# EAGLE design sch (EAGLE 9.3.1)
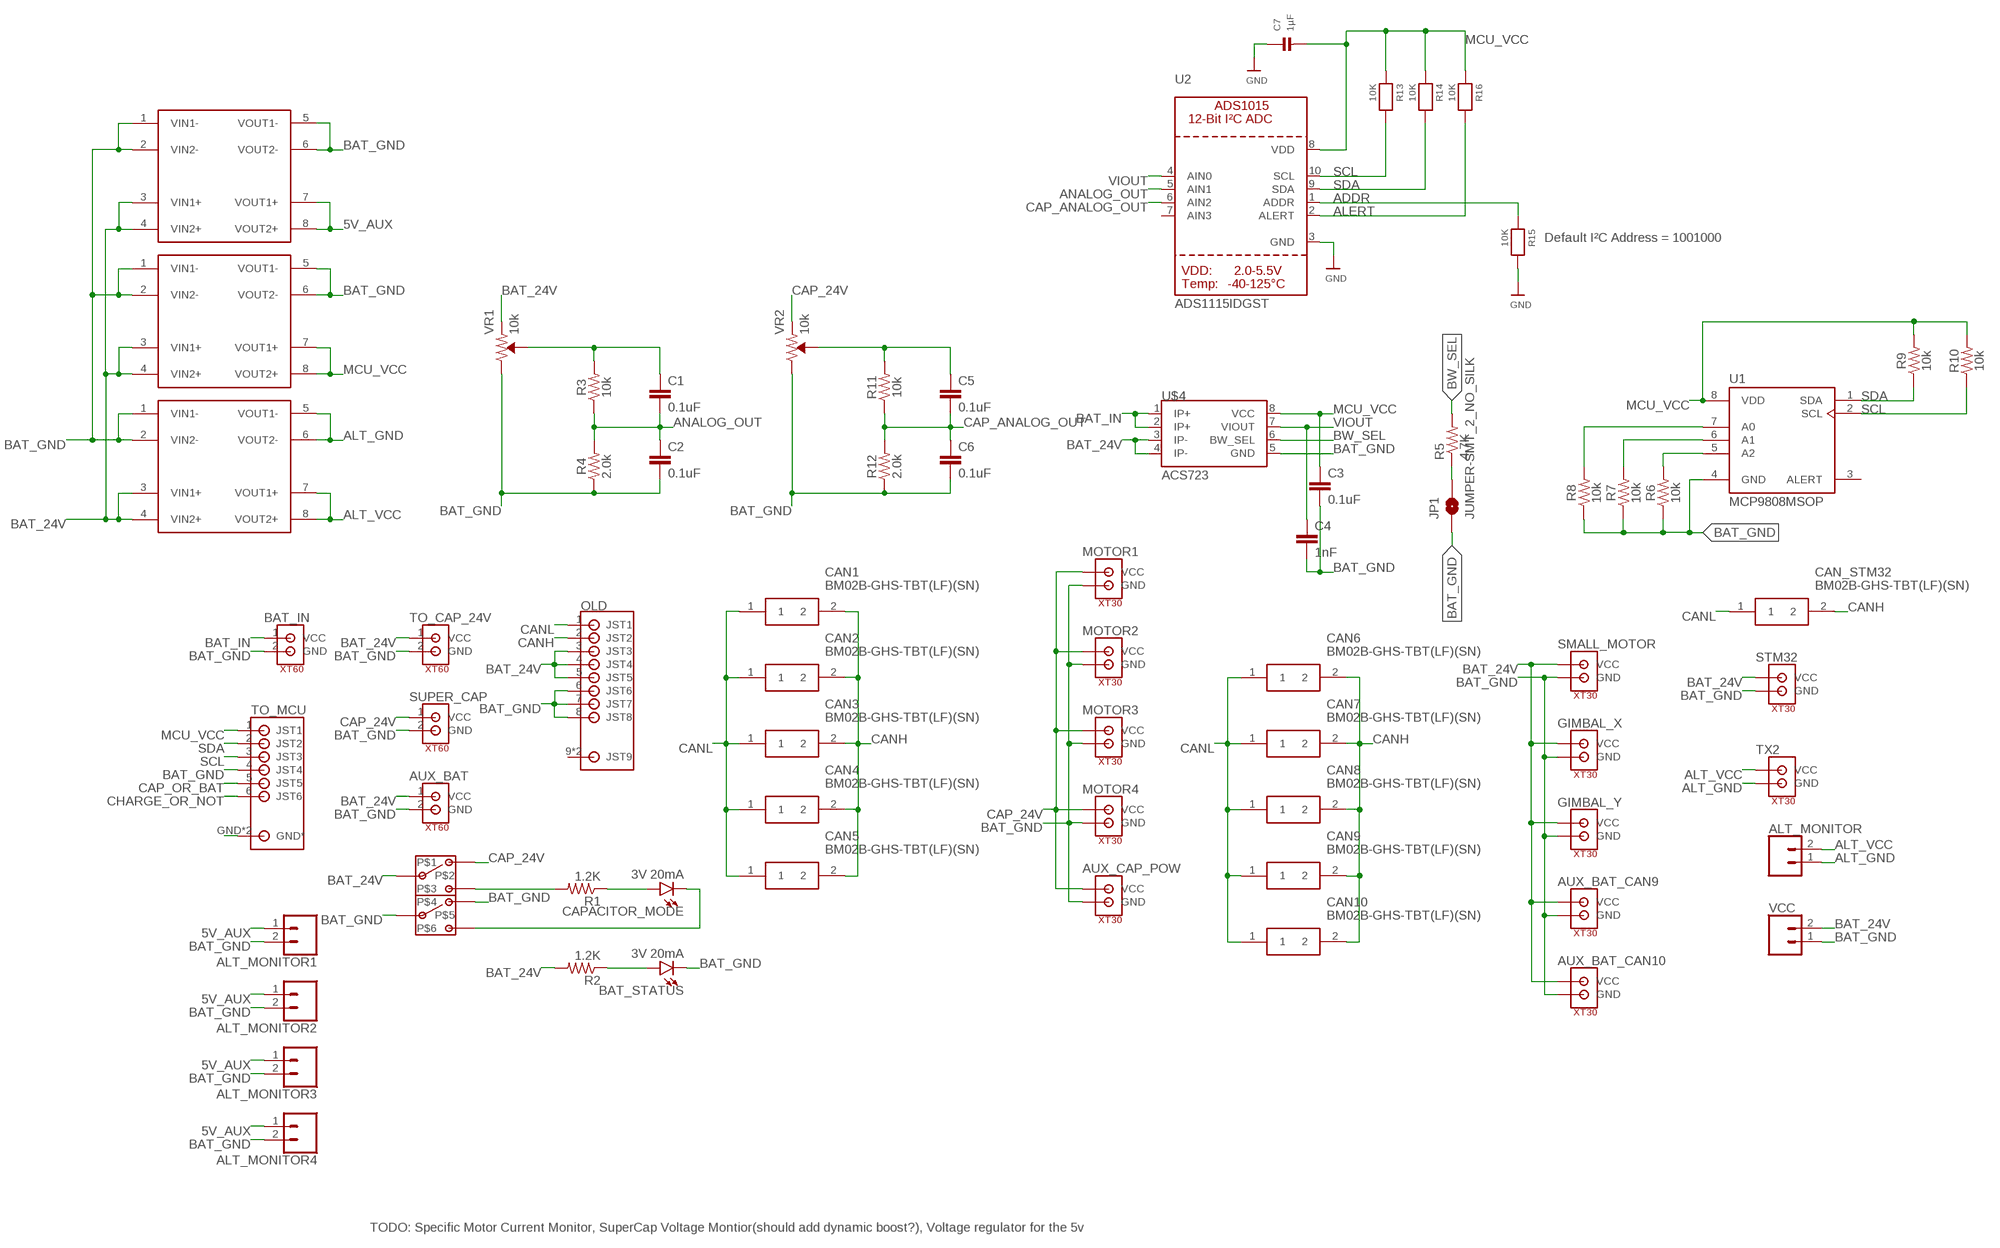
[diagram p0: schematic, sheet 1]

## Parts
ALT_MONITOR  CONN_02  [1X02]
ALT_MONITOR1  CONN_02  [1X02]
ALT_MONITOR2  CONN_02  [1X02]
ALT_MONITOR3  CONN_02  [1X02]
ALT_MONITOR4  CONN_02  [1X02]
AUX_BAT  XT60  [XT60]
AUX_BAT_CAN9  XT30  [XT30]
AUX_BAT_CAN10  XT30  [XT30]
AUX_CAP_POW  XT30  [XT30]
BAT_IN  XT60  [XT60]
BAT_STATUS  3V 20mA  LED1206  [LED-1206]
C1  0.1uF  0.1UF-0603-25V-(+80/-20%)  [0603]
C2  0.1uF  0.1UF-0603-25V-(+80/-20%)  [0603]
C3  0.1uF  0.1UF-0603-25V-(+80/-20%)  [0603]
C4  1nF  1.0NF/1000PF-0603-50V-10%  [0603]
C5  0.1uF  0.1UF-0603-25V-(+80/-20%)  [0603]
C6  0.1uF  0.1UF-0603-25V-(+80/-20%)  [0603]
C7  1µF  CAP_CERAMIC0805  [0805]
CAN1  BM02B-GHS-TBT(LF)(SN)  [BM02B-GHS-TBT_1]
CAN2  BM02B-GHS-TBT(LF)(SN)  [BM02B-GHS-TBT_1]
CAN3  BM02B-GHS-TBT(LF)(SN)  [BM02B-GHS-TBT_1]
CAN4  BM02B-GHS-TBT(LF)(SN)  [BM02B-GHS-TBT_1]
CAN5  BM02B-GHS-TBT(LF)(SN)  [BM02B-GHS-TBT_1]
CAN6  BM02B-GHS-TBT(LF)(SN)  [BM02B-GHS-TBT_1]
CAN7  BM02B-GHS-TBT(LF)(SN)  [BM02B-GHS-TBT_1]
CAN8  BM02B-GHS-TBT(LF)(SN)  [BM02B-GHS-TBT_1]
CAN9  BM02B-GHS-TBT(LF)(SN)  [BM02B-GHS-TBT_1]
CAN10  BM02B-GHS-TBT(LF)(SN)  [BM02B-GHS-TBT_1]
CAN_STM32  BM02B-GHS-TBT(LF)(SN)  [BM02B-GHS-TBT_1]
CAPACITOR_MODE  3V 20mA  LED1206  [LED-1206]
GIMBAL_X  XT30  [XT30]
GIMBAL_Y  XT30  [XT30]
JP1  JUMPER-SMT_2_NO_SILK  [SMT-JUMPER_2_NO_SILK]
MOTOR1  XT30  [XT30]
MOTOR2  XT30  [XT30]
MOTOR3  XT30  [XT30]
MOTOR4  XT30  [XT30]
OLD  S8B-PH-SM4_TB  [S8B-PH-SM4_TB]
R1  1.2K  RESISTOR2010  [R2010]
R2  1.2K  RESISTOR2010  [R2010]
R3  10k  10KOHM-0603-1/10W-1%  [0603]
R4  2.0k  2.0KOHM-0603-1/10W-5%  [0603]
R5  4.7K  4.7KOHM-1/10W-1%(0603)  [0603-RES]
R6  10k  10KOHM-0603-1/10W-1%  [0603]
R7  10k  10KOHM-0603-1/10W-1%  [0603]
R8  10k  10KOHM-0603-1/10W-1%  [0603]
R9  10k  10KOHM-0603-1/10W-1%  [0603]
R10  10k  10KOHM-0603-1/10W-1%  [0603]
R11  10k  10KOHM-0603-1/10W-1%  [0603]
R12  2.0k  2.0KOHM-0603-1/10W-5%  [0603]
R13  10K  RESISTOR0805  [0805]
R14  10K  RESISTOR0805  [0805]
R15  10K  RESISTOR0805  [0805]
R16  10K  RESISTOR0805  [0805]
SMALL_MOTOR  XT30  [XT30]
STM32  XT30  [XT30]
SUPER_CAP  XT60  [XT60]
TO_CAP_24V  XT60  [XT60]
TO_MCU  S6B-PH-SM4_TB  [S6B-PH-SM4_TB]
TX2  XT30  [XT30]
U1  MCP9808MSOP  [MSOP-8]
U2  ADS1115IDGST  ADC_ADS1015  [MSOP10]
U$1  MP1584  [MP1584_AMAZON]
U$2  MP1584  [MP1584_AMAZON]
U$3  DPDT  [DPDT]
U$4  ACS723  [SO08]
U$5  MP1584  [MP1584_AMAZON]
VCC  CONN_02  [1X02]
VR1  10k  TRIMPOT-SMD-3MM-OPEN-1/10W-25%  [TRIMPOT-SMD-TC33X]
VR2  10k  TRIMPOT-SMD-3MM-OPEN-1/10W-25%  [TRIMPOT-SMD-TC33X]

## Nets
5V_AUX: ALT_MONITOR1.1 ALT_MONITOR2.1 ALT_MONITOR3.1 ALT_MONITOR4.1 U$5.7(VOUT1+) U$5.8(VOUT2+)
ADDR: R15.1 U2.1(ADDR)
ALERT: R16.2 U2.2(ALERT)
ALT_GND [sig]: ALT_MONITOR.1 TX2.P$1(GND) U$2.5(VOUT1-) U$2.6(VOUT2-)
ALT_VCC [sig]: ALT_MONITOR.2 TX2.P$2(VCC) U$2.7(VOUT1+) U$2.8(VOUT2+)
ANALOG_OUT [sig]: C1.2 C2.1 R3.1 R4.2 U2.5(AIN1)
BAT_24V: AUX_BAT.1(VCC) AUX_BAT_CAN9.P$2(VCC) AUX_BAT_CAN10.P$2(VCC) GIMBAL_X.P$2(VCC) GIMBAL_Y.P$2(VCC) OLD.3(JST3) OLD.4(JST4) OLD.5(JST5) R2.2 SMALL_MOTOR.P$2(VCC) STM32.P$2(VCC) TO_CAP_24V.1(VCC) U$1.3(VIN1+) U$1.4(VIN2+) U$2.3(VIN1+) U$2.4(VIN2+) U$3.P$2 U$4.3(IP-) U$4.4(IP-) U$5.3(VIN1+) U$5.4(VIN2+) VCC.2 VR1.3(CCW)
BAT_GND: ALT_MONITOR1.2 ALT_MONITOR2.2 ALT_MONITOR3.2 ALT_MONITOR4.2 AUX_BAT.2(GND) AUX_BAT_CAN9.P$1(GND) AUX_BAT_CAN10.P$1(GND) AUX_CAP_POW.P$1(GND) BAT_IN.2(GND) BAT_STATUS.C C2.2 C3.2 C4.2 C6.2 GIMBAL_X.P$1(GND) GIMBAL_Y.P$1(GND) JP1.1 MOTOR1.P$1(GND) MOTOR2.P$1(GND) MOTOR3.P$1(GND) MOTOR4.P$1(GND) OLD.6(JST6) OLD.7(JST7) OLD.8(JST8) R4.1 R6.1 R7.1 R8.1 R12.1 SMALL_MOTOR.P$1(GND) STM32.P$1(GND) SUPER_CAP.2(GND) TO_CAP_24V.2(GND) TO_MCU.4(JST4) U1.4(GND) U$1.1(VIN1-) U$1.2(VIN2-) U$1.5(VOUT1-) U$1.6(VOUT2-) U$2.1(VIN1-) U$2.2(VIN2-) U$3.P$4 U$3.P$5 U$4.5(GND) U$5.1(VIN1-) U$5.2(VIN2-) U$5.5(VOUT1-) U$5.6(VOUT2-) VCC.1 VR1.1(CW) VR2.1(CW)
BAT_IN: BAT_IN.1(VCC) U$4.1(IP+) U$4.2(IP+)
BW_SEL [sig]: R5.2 U$4.6(BW_SEL)
CANH [sig]: CAN1.2 CAN2.2 CAN3.2 CAN4.2 CAN5.2 CAN6.2 CAN7.2 CAN8.2 CAN9.2 CAN10.2 CAN_STM32.2 OLD.2(JST2)
CANL [sig]: CAN1.1 CAN2.1 CAN3.1 CAN4.1 CAN5.1 CAN6.1 CAN7.1 CAN8.1 CAN9.1 CAN10.1 CAN_STM32.1 OLD.1(JST1)
CAP_24V: AUX_CAP_POW.P$2(VCC) MOTOR1.P$2(VCC) MOTOR2.P$2(VCC) MOTOR3.P$2(VCC) MOTOR4.P$2(VCC) SUPER_CAP.1(VCC) U$3.P$1 VR2.3(CCW)
CAP_ANALOG_OUT: C5.2 C6.1 R11.1 R12.2 U2.6(AIN2)
CAP_OR_BAT: TO_MCU.5(JST5)
CHARGE_OR_NOT: TO_MCU.6(JST6)
GND: C7.1 R15.2 U2.3(GND)
MCU_VCC [sig]: C3.1 C7.2 R9.2 R10.2 R13.1 R14.1 R16.1 TO_MCU.1(JST1) U1.8(VDD) U2.8(VDD) U$1.7(VOUT1+) U$1.8(VOUT2+) U$4.8(VCC)
N$1 [sig]: R1.2 U$3.P$3
N$2 [sig]: CAPACITOR_MODE.A R1.1
N$3 [sig]: CAPACITOR_MODE.C U$3.P$6
N$4 [sig]: JP1.2 R5.1
N$5 [sig]: BAT_STATUS.A R2.1
N$6 [sig]: C5.1 R11.2 VR2.2(WIPER)
N$7: TO_MCU.GND2(GND*) TO_MCU.GND(GND*)
N$8 [sig]: C1.1 R3.2 VR1.2(WIPER)
N$13 [sig]: R8.2 U1.7(A0)
N$14 [sig]: R7.2 U1.6(A1)
N$15 [sig]: R6.2 U1.5(A2)
SCL [sig]: R10.1 R13.2 TO_MCU.3(JST3) U1.2(SCL) U2.10(SCL)
SDA [sig]: R9.1 R14.2 TO_MCU.2(JST2) U1.1(SDA) U2.9(SDA)
VIOUT [sig]: C4.1 U2.4(AIN0) U$4.7(VIOUT)
Unconnected: OLD.9(JST9) OLD.10(JST9) U1.3(ALERT) U2.7(AIN3)

## Notes on the sheet
- Default I²C Address = 1001000
- TODO: Specific Motor Current Monitor, SuperCap Voltage Montior(should add dynamic boost?), Voltage regulator for the 5v

## Library data of the parts
ALT_MONITOR ALT_MONITOR1-ALT_MONITOR4 VCC = SparkFun-Connectors:CONN_02: Multi connection point. Often used as Generic Header-pin footprint for 0.1 inch spaced/style header connections On any of the 0.1 inch spaced packages, you can populate with these: Break Away Headers - Straight <https://www.sparkfun.com/products/116> (PRT-00116) Break Away Male Headers - Right Angle <https://www.sparkfun.com/products/553> (PRT-00553) Female Headers <https://www.sparkfun.com/products/115> (PRT-00115) Break Away Headers - Machine Pin <https://www.sparkfun.com/products/117> (PRT-00117) Break Away Female Headers - Swiss Machine Pin <https://www.sparkfun.com/products/743> (PRT-00743) For SCREWTERMINALS and SPRING TERMINALS visit here: Screw Terimnals on SparkFun.com <https://www.sparkfun.com/search/results?term=Screw+Terminals> (5mm/3.5mm/2.54mm spacing) This device is also useful as a general connection point to wire up your design to another part of your project. Our various solder wires solder well into these plated through hole pads. Hook-Up Wire - Assortment (Stranded, 22 AWG) <https://www.sparkfun.com/products/11375> (PRT-11375) Hook-Up Wire - Assortment (Solid Core, 22 AWG) <https://www.sparkfun.com/products/11367> (PRT-11367) View the entire wire category on our website here <https://www.sparkfun.com/categories/141> Special notes: Molex polarized connector foot print use with: PRT-08233 with associated crimp pins and housings. 2.54_SCREWTERM for use with PRT-10571. 3.5mm Screw Terminal footprints for PRT-08084 5mm Screw Terminal footprints for use with PRT-08432
AUX_BAT BAT_IN SUPER_CAP TO_CAP_24V = NewKevinMade:XT60
AUX_BAT_CAN9 AUX_BAT_CAN10 AUX_CAP_POW GIMBAL_X GIMBAL_Y MOTOR1-MOTOR4 SMALL_MOTOR STM32 TX2 = NewKevinMade:XT30
BAT_STATUS CAPACITOR_MODE = SparkFun-LED:LED: LED (Generic) Standard schematic elements and footprints for 5mm, 3mm, 1206, and 0603 sized LEDs. Generic LEDs with no color specified.
C1-C3 C5 C6 = SparkFun-Capacitors:0.1UF: 0.1µF ceramic capacitors A capacitor is a passive two-terminal electrical component used to store electrical energy temporarily in an electric field.; PROD_ID: CAP-00810
C4 = SparkFun-Capacitors:1.0NF/1000PF: 1nF/1,000pF ceramic capacitors A capacitor is a passive two-terminal electrical component used to store electrical energy temporarily in an electric field.; PROD_ID: CAP-07886
C7 = microbuilder:CAP_CERAMIC: Ceramic Capacitors 0402 - 0402 Surface Mount Capacitors 16pF 50V 5% [Digikey: 445-4899-2-ND] 18pF 50V 5% [Digikey: 490-1281-2-ND] 22pF 50V 5% [Digikey: 490-1283-2-ND] 68pF 50V 5% [Digikey: 490-1289-2-ND] 0.1uF 10V 10% [Digikey: 490-1318-2-ND] 1.0uF 6.3V 10% [Digikey: 490-1320-2-ND] 0603 - 0603 Surface Mount Capacitors 16 pF 50V 5% [Digikey: 445-5051-2-ND] 22 pF 50V [Digikey: PCC220ACVTR-ND] 33 pF 50V 5% [Digikey: 490-1415-1-ND] 56pF 50V 5% [Digikey: 490-1421-1-ND] 220pF 50V 5% [Digikey: 445-1285-1-ND] 680 pF 50V 2200 pF 50V 5% C0G [Digikey: 445-1297-1-ND] 5600 pF 100V 5% X7R [Digikey: 478-3711-1-ND] 0.1 µF 25V 10% [Digikey: PCC2277TR-ND] 0.22 µF 16V 10% X7R [Digikey: 445-1318-1-ND] 1.0 µF 25V 10% [Digikey: 445-5146-2-ND] 0603 - RF Specific 3pF 250V +/-0.1pF RF [Digikey: 712-1347-1-ND] 18 pF 250V 5% [Digikey: 478-3505-1-ND or 712-1322-1-ND] 56 pF 250V 5% C0G RF [Digikey: 490-4867-1-ND] 68 pF 250V RF [Digikey: 490-4868-1-ND] 0805 - 0805 Surface Mount Capacitors 220 pF 250V 2% RF Ceramic Capacitor [Digikey: 712-1398-1-ND] 1000 pF 50V 2% NP0 Ceramic Capacitor [Digikey: 478-3760-1-ND] 0.1 µF 25V 10% Ceramic Capacitor [Digikey: PCC1828TR-ND] 1.0 µF 16V 10% Ceramic Capacitor[Digikey: 490-1691-2-ND] 10.0 µF 10V 10% Ceramic Capacitor[Digikey: 709-1228-1-ND] 10.0 uF 16V 10% Ceramic Capacitor [Digikey: 478-5165-2-ND] 47 uF 6.3V 20% Ceramic Capacitor [Digikey: 587-1779-1-ND or 399-5506-1-ND] 1206 - 1206 Surface Mount Capacitors 47uF 10V 20% Ceramic Capacitor [Digikey: 490-5528-1-ND or 399-5508-1-ND or 445-6010-1-ND] 100uF 6.3V -20%, +80% Y5V Ceramic Capacitor (Digikey: 490-4512-1-ND, Mouser: 81-GRM31CF50J107ZE1L)
CAN1-CAN10 CAN_STM32 = SamacSys_Parts:BM02B-GHS-TBT(LF)(SN): GH 1.25mm header top entry 2 way JST GH Series, 1.25mm Pitch 2 Way Shrouded Straight PCB Header, Surface Mount, Solder Termination Source: Datasheet <http://uk.rs-online.com/web/p/products/7521762P>; DESCRIPTION: GH 1.25mm header top entry 2 way JST GH Series, 1.25mm Pitch 2 Way Shrouded Straight PCB Header, Surface Mount, Solder Termination; HEIGHT: mm; MANUFACTURER_NAME: JST (JAPAN SOLDERLESS TERMINALS); MANUFACTURER_PART_NUMBER: BM02B-GHS-TBT(LF)(SN); RS_PART_NUMBER: 7521762P
JP1 = SparkFun-Jumpers:JUMPER-SMT_2_NO: Normally open jumper This jumper has two pads in close proximity to each other. Apply solder to close the connection. Round pads are easier to solder for beginners, but are a lot larger. SparkFun Product that uses the round pads: SparkFun EL Sequencer <https://www.sparkfun.com/products/12781>
OLD = KevinMade:S8B-PH-SM4_TB
R1 R2 = SparkFun-Passives:RESISTOR: Resistor Basic schematic elements and footprints for 0603, 1206, and PTH resistors.
R3 R6-R11 = SparkFun-Resistors:10KOHM: 10kΩ resistor A resistor is a passive two-terminal electrical component that implements electrical resistance as a circuit element. Resistors act to reduce current flow, and, at the same time, act to lower voltage levels within circuits. - Wikipedia; PROD_ID: RES-00824
R4 R12 = SparkFun-Resistors:2.0KOHM: 2kΩ resistor A resistor is a passive two-terminal electrical component that implements electrical resistance as a circuit element. Resistors act to reduce current flow, and, at the same time, act to lower voltage levels within circuits. - Wikipedia; PROD_ID: RES-08296
R5 = SparkFun-Resistors:4.7KOHM-1/10W-1%(0603): RES-07857; PROD_ID: RES-07857
R13-R16 = microbuilder:RESISTOR: Resistors 0402 - 0402 Surface Mount Package 22 Ohm 1% 1/16W [Digikey: 311-22.0LRTR-ND] 33 Ohm 5% 1/16W 1.0K 5% 1/16W 1.5K 5% 1/16W 2.0K 1% 1/16W 10.0K 1% 1/16W [Digikey: 311-10.0KLRTR-ND] 10.0K 5% 1/16W [Digikey: RMCF0402JT10K0TR-ND] 12.1K 1% 1/16W [Digikey: 311-22.0LRTR-ND] 100.0K 5% 1/16W 0603 - 0603 Surface Mount Package 0 Ohm 1/10 Watt 1% Resistor 15 Ohm 1/10 Watt 1% Resistor 33 Ohm 1/10 Watt 1% Resistor 49.9 Ohm 1/10 Watt 1% Resistor 100 Ohm 1/10 Watt 1% Resistor 150 Ohm 1/10 Watt 1% Resistor 240 Ohm 1/10 Watt 1% Resistor 390 Ohm 1/10 Watt 1% Resistor 560 Ohm 1/10 Watt 1% Resistor 680 Ohm 1/10 Watt 1% Resistor 750 Ohm 1/10 Watt 1% Resistor 1.0K Ohm 1/10 Watt 1% Resistor 1.5K Ohm 1/10 Watt 1% Resistor 2.0K Ohm 1/10 Watt 1% Resistor 2.2K Ohm 1/10 Watt 1% Resistor 3.3K Ohm 1/10 Watt 1% Resistor 4.7K Ohm 1/10 Watt 1% Resistor 10.0K Ohm 1/10 Watt 1% Resistor 12.0K Ohm 1/10 Watt 1% Resistor 12.1K Ohm 1/10 Watt 1% Resistor 20.0K Ohm 1/10 Watt 1% Resistor 33.0K Ohm 1/10 Watt 1% Resistor 100.0K Ohm 1/10 Watt 1% Resistor 0805 - 0805 Surface Mount Package 0 Ohm 1/8 Watt 1% Resistor 33 Ohm 1/8 Watt 1% Resistor 100 Ohm 1/8 Watt 1% Resistor 150 Ohm 1/8 Watt 1% Resistor 200 Ohm 1/8 Watt 1% Resistor 240 Ohm 1/8 Watt 1% Resistor 330 Ohm 1/8 Watt 1% Resistor 390 Ohm 1/8 Watt 1% Resistor 470 Ohm 1/8 Watt 1% Resistor 1.0K Ohm 1/8 Watt 1% Resistor 1.5K Ohm 1/8 Watt 1% Resistor 2.0K Ohm 1/8 Watt 1% Resistor 4.7K Ohm 1/8 Watt 1% Resistor 5.1K Ohm 1/8 Watt 1% Resistor 5.6K Ohm 1/8 Watt 1% Resistor 10.0K Ohm 1/8 Watt 1% Resistor 22.0K Ohm 1/8 Watt 1% Resistor 33.0K Ohm 1/8 Watt 1% Resistor 100K Ohm 1/8 Watt 1% Resistor 1206 - 1206 Surface Mount Package 2012 - 2010 Surface Mount Package 0.11 Ohm 1/2 Watt 1% Resistor - Digikey: RHM.11UCT-ND
TO_MCU = NewKevinMade:S6B-PH-SM4_TB
U1 = MCP9808:MCP9808; AVAILABILITY: Unavailable; DESCRIPTION: MCP9808 Series SMD 3.6 V Memory Module Digital Temperature Sensor - MSOP-8; MF: Microchip; MP: MCP9808-E/MS; PACKAGE: MSOP-8 Microchip; PRICE: None
U2 = microbuilder:ADC_ADS1015: ADS1015 - 12-bit 4-Channel I2C ADC with Internal PGA VDD: 2.0-5.5V Sampling Rate: 3.3ksps Gain Settings: 2/3, 1, 2, 4, 8, 16 I2C Address: ADDR low = 1001000x, ADDR high = 1001001x Internal Comparator The ADS1015 includes an internal comparator that can be set to output a high-level on ALERT when the conversion results exceeeds a pre-defined upper level, and will deassert itself when the level falls below a pre-defined lower threshold level. It can also be set to windowed mode where the ALERT pin will be asserted if the data exceeds the upper threshold or falls below the lower threshold.
U$1 U$2 U$5 = NewKevinMade:MP1584
U$3 = NewKevinMade:DPDT
U$4 = SparkFun-Sensors:ACS723; PART_#: ACS723ACS723LLCTR-05AB-T2; PROD_ID: IC-13872
VR1 VR2 = SparkFun-Resistors:TRIMPOT: Trimming Potentiometer (Trimpot) Three-terminal potentiometers, with an adjustable wiper and two adjustable resistors. A pot can be used to create a configurable voltage divider, or as a variable resistor. "Trimpots" are a subset of potentiometers, usually intended for "set-and-forget" applications. They're often more delicate than standard potentiometers - rated for fewer turns. Variants PTH-KNOB - PTH Trimpot w/ finger-adjustable knob Trimpot 10K with Knob <https://www.sparkfun.com/products/9806> (COM-09806) Datasheet <http://www.sparkfun.com/datasheets/Components/General/TSR-3386.pdf> SMD-3MM-CLOSED-FRAME - SMD 3mm Square Closed-Frame Trimpot Used on e.g. EasyDriver - Stepper Motor Driver <https://www.sparkfun.com/products/12779> Datasheet <http://www.bitechnologies.com/pdfs/22.pdf> (22AR10KTR) SMD-5MM - SMD 5mm Square Closed-Frame Trimpot Used on e.g. IOIO-OTG - V2.2 <https://www.sparkfun.com/products/13613> Datasheet <http://www.vishay.com/docs/51008/ts53.pdf> (TS53YL502MR10) SMD-3MM-1/10W-25% - 3mm Square Open-Frame Trimpot Used on e.g. SparkFun Shapeoko <https://www.sparkfun.com/products/13899> Datasheet <http://www.bourns.com/docs/Product-Datasheets/TC33.pdf> (TC33X-2-103E); PROD_ID: RES-12428, RES-08048

## Net classes
0 default: width 1.778 mm, drill 1.016 mm, clearance 0.508 mm
1 sig: width 0.254 mm, drill 0.305 mm, clearance 0.254 mm

## Board
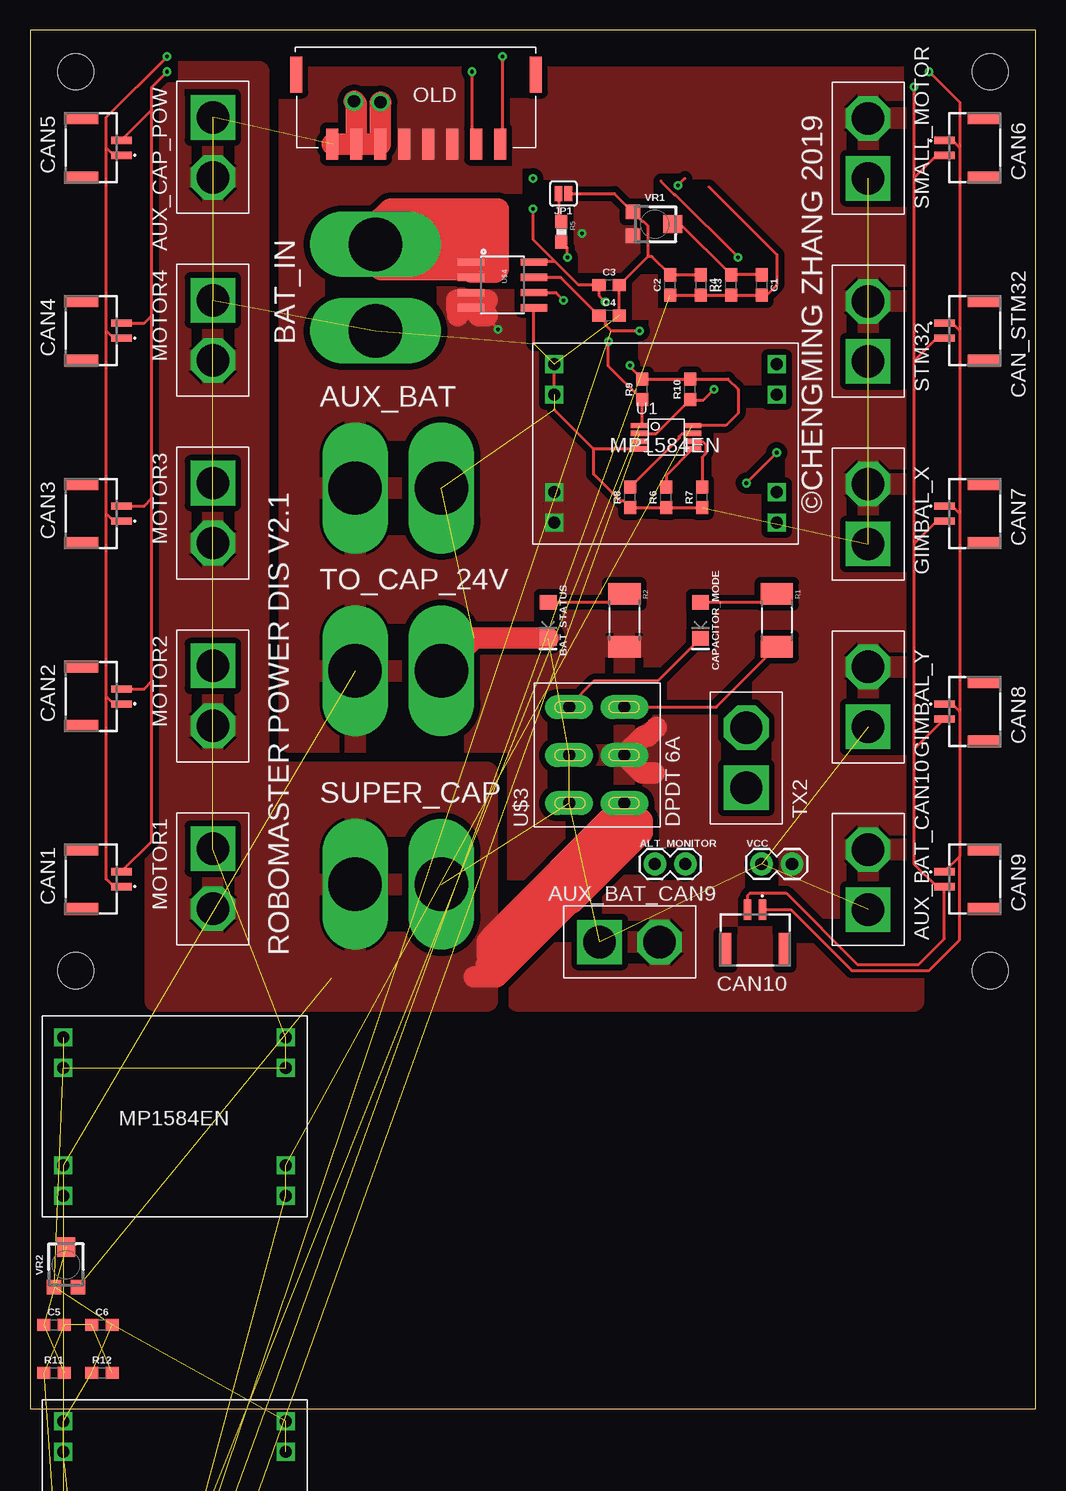
[diagram p1: board, top side]
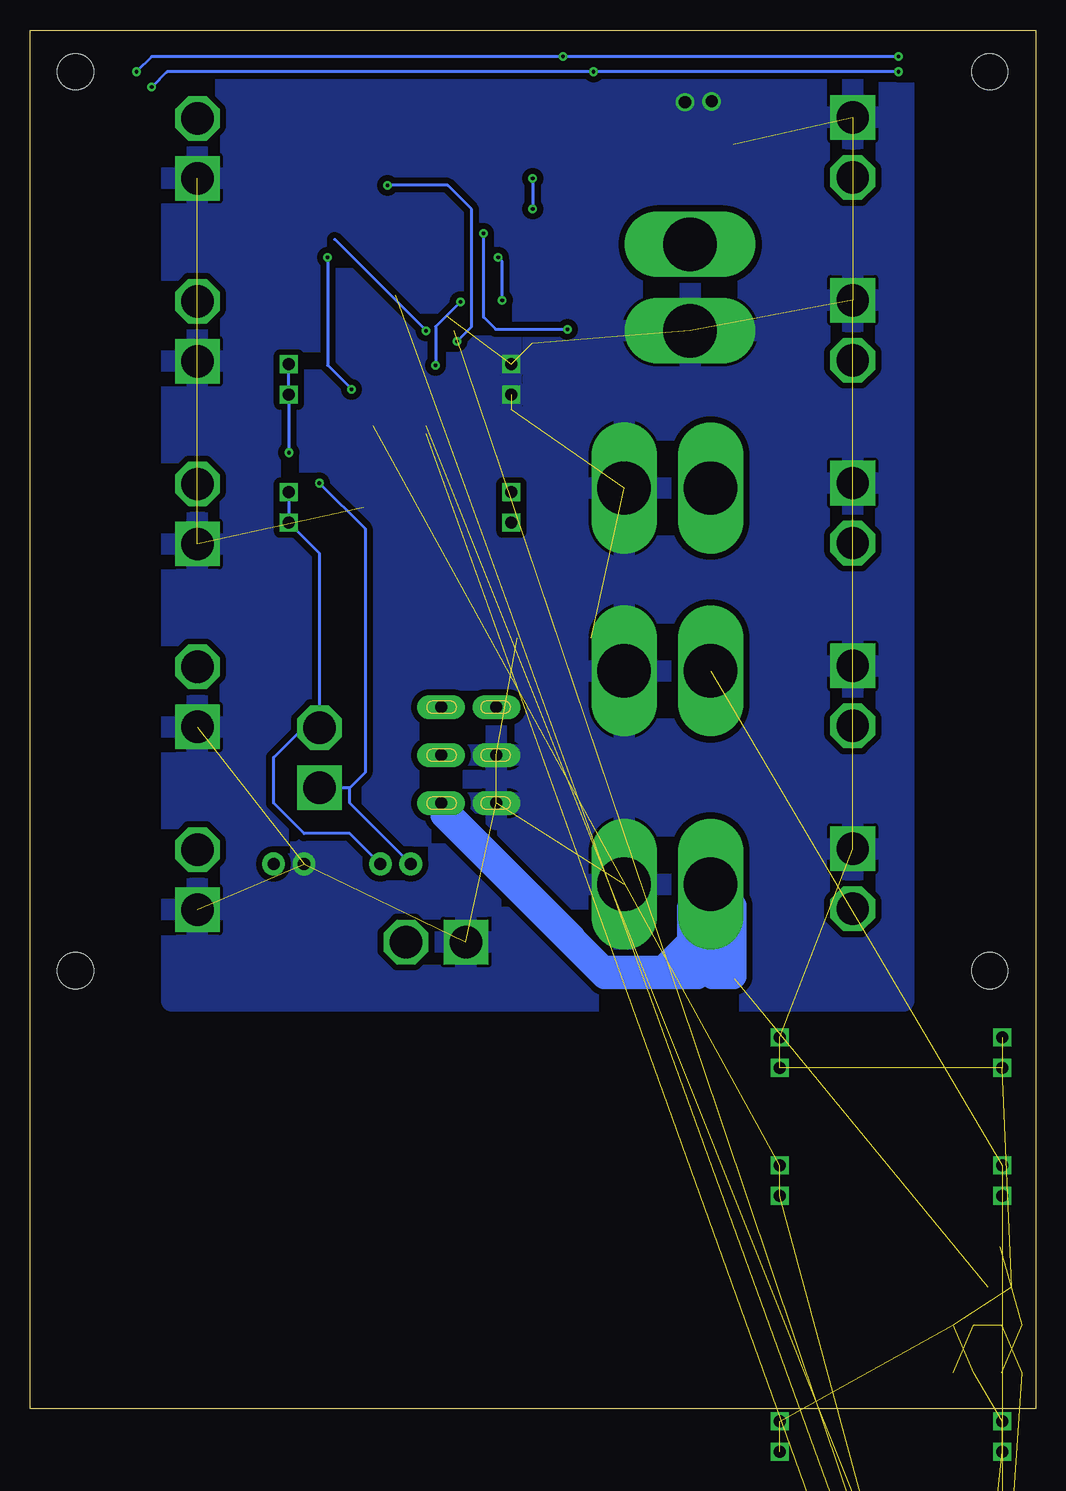
[diagram p2: board, bottom side, seen from below]

Size 83.8 x 114.95 mm. Coordinates in mm from the lower left corner, seen from the top.
Outline: 0,0 83.8,0 83.8,114.95 0,114.95 0,0
Copper layers (1*16): Top 0.035mm / dielectric 1.5mm / Bottom 0.035mm
Design rules "default": minimum track width 6mil, minimum drill 0.35mm, track to track 6mil, track to pad 6mil, pad to pad 6mil, via to via 6mil, smd to smd 6mil, copper to edge 40mil, drill to drill 6mil, minimum pad ring 10mil, minimum via ring 8mil, stop-mask expansion 4mil, vias tented up to drill 0mil, thermal gap 10mil
Holes 3 mm at 3.81,111.47 80.01,111.47 80.01,36.54 3.81,36.54
Milling: 24 lines

### Footprints (pad centres in the part's own frame; a part is rotated, then mirrored left to right if it is on the bottom)
1X02 = drill 1.016 pad 1.88: 1 0,0; 2 2.54,0
XT60 = drill 4.45 long: 1 -7.2,7.2; 2 0,7.2
XT30 = drill 2.7 square: P$1 0,0 | drill 2.7 octagon: P$2 5,0
LED-1206 = smd 1.2 x 1.4: A -1.5,0; C 1.5,0
0603 = smd 1.1 x 1: 1 -0.85,0; 2 0.85,0
0805 = smd 1.3 x 1.5: 1 -0.95,0; 2 0.95,0
BM02B-GHS-TBT_1 = smd 0.6 x 1.7: 1 0.625,0; 2 -0.625,0 | smd 1 x 2.8: 3 -2.475,-3.35; 4 2.475,-3.35
SMT-JUMPER_2_NO_SILK = smd 0.635 x 1.27: 1 -0.406,0; 2 0.406,0
S8B-PH-SM4_TB = smd 1 x 2.6: 1 4,7.3; 2 6,7.3; 3 8,7.3; 4 10,7.3; 5 12,7.3; 6 14,7.3; 7 16,7.3; 8 18,7.3 | smd 1 x 3: 9 1.016,1.5; 10 20.984,1.5
R2010 = smd 1.8 x 2.7: 1 -2.2,0; 2 2.2,0
0603-RES = smd 1.1 x 1: 1 -0.85,0; 2 0.85,0
S6B-PH-SM4_TB = smd 1 x 2.6: 1 5.46,9.68; 2 7.46,9.68; 3 9.46,9.68; 4 11.46,9.68; 5 13.46,9.68; 6 15.46,9.68 | smd 1 x 3: GND 2.476,3.88; GND2 18.444,3.88
MSOP-8 = smd 1.45 x 0.45: 1 -2.2,0.975; 2 -2.2,0.325; 3 -2.2,-0.325; 4 -2.2,-0.975; 5 2.2,-0.975; 6 2.2,-0.325; 7 2.2,0.325; 8 2.2,0.975
MSOP10 = smd 0.25 x 1: 1 -1,-2.113; 2 -0.5,-2.113; 3 0,-2.113; 4 0.5,-2.113; 5 1,-2.113; 6 1,2.113; 7 0.5,2.113; 8 0,2.113; 9 -0.5,2.113; 10 -1,2.113
MP1584_AMAZON = drill 1 square: 1 1.778,14.986; 2 1.778,12.446; 3 1.778,4.318; 4 1.778,1.778; 5 20.32,14.986; 6 20.32,12.446; 7 20.32,4.318; 8 20.32,1.778
DPDT = drill 1 pad 2 long: P$1 0,0; P$2 4,0; P$3 8,0; P$4 0,4.6; P$5 4,4.6; P$6 8,4.6
SO08 = smd 0.61 x 2.21: 1 -1.905,-2.616; 2 -0.635,-2.616; 3 0.635,-2.616; 4 1.905,-2.616; 5 1.905,2.616; 6 0.635,2.616; 7 -0.635,2.616; 8 -1.905,2.616
TRIMPOT-SMD-TC33X = smd 1.2 x 1.2: 1 -1,-1.825; 3 1,-1.825 | smd 1.5 x 1.6: 2 0,1.5

### Placement (x,y rotation side)
ALT_MONITOR  52.07,45.43 0 top
ALT_MONITOR1  2,-20 0 top  (outside the outline)
ALT_MONITOR2  2,-24 0 top  (outside the outline)
ALT_MONITOR3  2,-28 0 top  (outside the outline)
ALT_MONITOR4  2,-32 0 top  (outside the outline)
AUX_BAT  34.29,69.56 0 top
AUX_BAT_CAN9  47.47,38.92 0 top
AUX_BAT_CAN10  69.85,41.62 90 top
AUX_CAP_POW  15.24,107.66 270 top
BAT_IN  21.59,89.88 270 top
BAT_STATUS  43.18,65.75 270 top
C1  60.96,93.69 270 top
C2  53.34,93.69 90 top
C3  48.26,93.69 0 top
C4  48.26,91.15 0 top
C5  2,7 0 top
C6  6,7 0 top
C7  9,-49 0 top  (outside the outline)
CAN1  7.62,44.16 270 top
CAN2  7.62,59.4 270 top
CAN3  7.62,74.64 270 top
CAN4  7.62,89.88 270 top
CAN5  7.62,105.12 270 top
CAN6  76.2,105.12 90 top
CAN7  76.2,74.64 90 top
CAN8  76.2,58.13 90 top
CAN9  76.2,44.16 90 top
CAN10  60.42,41.62 0 top
CAN_STM32  76.2,89.88 90 top
CAPACITOR_MODE  55.88,65.75 270 top
GIMBAL_X  69.85,72.1 90 top
GIMBAL_Y  69.85,56.86 90 top
JP1  44.45,101.31 180 top
MOTOR1  15.24,46.7 270 top
MOTOR2  15.24,61.94 270 top
MOTOR3  15.24,77.18 270 top
MOTOR4  15.24,92.42 270 top
OLD  43.18,112.74 180 top
R1  62.23,65.75 270 top
R2  49.53,65.75 270 top
R3  58.42,93.69 90 top
R4  55.88,93.69 270 top
R5  44.29,98.13 270 top
R6  53,76 90 top
R7  56,76 90 top
R8  50,76 90 top
R9  51,85 90 top
R10  55,85 90 top
R11  2,3 0 top
R12  6,3 0 top
R13  8,-35 0 top  (outside the outline)
R14  2,-46 0 top  (outside the outline)
R15  9,-46 0 top  (outside the outline)
R16  2,-49 0 top  (outside the outline)
SMALL_MOTOR  69.85,102.58 90 top
STM32  69.85,87.34 90 top
SUPER_CAP  34.29,36.54 0 top
TO_CAP_24V  34.29,54.32 0 top
TO_MCU  -1,-62 0 top  (outside the outline)
TX2  59.69,51.78 90 top
U1  53,81 0 top
U2  3,-41 0 top  (outside the outline)
U$1  1,16 0 top
U$2  41.91,72.1 0 top
U$3  49.53,50.51 90 top
U$4  39.37,93.69 270 top
U$5  1,-16 0 top
VCC  60.96,45.43 0 top
VR1  52.07,98.77 270 top
VR2  3,12 0 top

### Tracks (layer width: path | path; a pad name or v marks a point on that pad's centre or on a via)
5V_AUX  (5 unrouted)
ADDR  (1 unrouted)
ALERT  (1 unrouted)
ALT_GND  (via drill 0.3)
  Top 0.254: v62.23,79.72 v59.69,77.18
  Bottom 0.254: U$2.5 U$2.6 v62.23,79.72 | v59.69,77.18 55.88,73.37 55.88,53.05 57.15,51.78 | 57.15,51.78 TX2.P$1 | ALT_MONITOR.1 57.15,50.51 57.15,51.78
ALT_VCC
  Bottom 0.254: U$2.7 U$2.8 59.69,71.34 59.69,56.86 | 59.69,56.86 TX2.P$2 | ALT_MONITOR.2 57.15,47.97 60.96,47.97 63.5,50.51 63.5,54.32 60.96,56.86 59.69,56.86
ANALOG_OUT  (1 unrouted)
  Top 0.254: C2.1 R4.2 R3.1 C1.2 | C1.2 60.96,92.95 | C1.2 61.38,92.84 62.23,93.69 62.23,96.23 56.58,101.88
BAT_24V  (via drill 0.3)  (4 unrouted)
  Top 0.254: v39,90 38.1,90.9 38.1,91.15
  Top 0.381: 36.75,92.98 U$4.3
  Top 0.762: U$4.4 36.75,92.98
  Top 1.778: 36.75,92.47 U$4.4 | U$4.4 37.39,92.42 38.1,92.42 | U$4.4 37.39,91.15 38.1,91.15 | U$4.4 36.2,91.78 35.56,92.42 35.56,91.68 35.65,91.59 35.65,91.15 | 52,53 51.04,53 U$3.P$2 51.13,56.11 51.52,56.11 52.2,56.8
  Bottom 0.254: v39,90 45,90 46,91 v46,98
  pour Top: 21.59,111.01 21.59,55.59 40.64,55.59 40.64,34 73.66,34 73.66,111.01
BAT_GND  (via drill 1.02)  (38 unrouted)
  Top 0.254: 41.99,88.79 U$4.5 | 51.48,96.06 51.48,98.63 51.11,99 51.01,99 VR1.1 48.7,101.31 JP1.1 | 51.48,96.06 C3.2 C4.2 | 51.48,96.06 51.82,96.06 C2.2 R4.1 | R7.1 R6.1 R8.1 49.48,75.66 49.24,75.66 46.98,77.93 46.98,80.03 | U1.4 46.98,80.03 | 46.98,80.03 43.69,83.31 | U$2.2 U$2.1
  Top 1.778: OLD.8 OLD.7 | OLD.7 OLD.6 29.18,108.9 v29.21,108.93 | BAT_STATUS.C 37.02,64.25 TO_CAP_24V.2 | OLD.7 27.18,108.82 v27,109
  pour Bottom: 11,112 11,34 72,34 72,112
BAT_IN
  Top 0.889: 36.75,94.76 U$4.2
  Top 1.778: BAT_IN.1 35.27,97.08 U$4.1 36.75,94.76 | 31.75,96.23 34.29,96.23 35.56,94.96 29.21,94.96 28.79,95.38 BAT_IN.1 | BAT_IN.1 29.64,96.23 30.48,96.23 | BAT_IN.1 29.71,98 36,98 37,97 | 37,97 37,95 36.76,94.76 | 36.76,94.76 36.75,94.76 | BAT_IN.1 30.71,99 36,99 37,98 | 37,98 37,97 | BAT_IN.1 28.79,98.79 30,100 37,100 | 37,100 37,98 | 37,100 39,100 39,95 38.76,94.76 36.76,94.76 | 36.75,94.76 38,96 38,99
BW_SEL  (via drill 0.3)
  Top 0.254: U$4.6 43.81,93.06 v44.45,92.42 | v44.78,96 44.78,96.79 R5.2
  Bottom 0.254: v44.78,96 44.45,95.67 v44.45,92.42
CANH  (via drill 0.3)
  Top 0.254: CAN1.2 10.16,47.33 10.16,60.67 | v11.43,111.47 10.16,110.2 10.16,108.28 | v73.66,110.2 73.66,102.58 | 73.66,102.58 73.66,87.34 | 73.66,87.34 73.66,72.1 | 73.66,72.1 73.66,54.97 | 73.66,54.97 73.66,45.43 75.56,43.53 CAN9.2 76.2,39.2 74.05,37.05 68.95,37.05 63,43 60,43 59.8,42.8 CAN10.2 | 10.16,60.67 10.16,75.91 | 10.16,75.91 10.16,91.15 | 10.16,91.15 10.16,108.28 | CAN2.2 9.52,60.02 10.16,60.67 | CAN3.2 9.52,75.27 10.16,75.91 | CAN4.2 9.52,90.5 10.16,91.15 | CAN5.2 10.16,108.28 | v36.83,111.47 36.83,105.79 OLD.2 | CAN6.2 75.58,104.5 73.66,102.58 | CAN_STM32.2 75.58,89.25 73.66,87.34 | CAN7.2 75.58,74.02 73.66,72.1 | CAN8.2 73.66,54.97
  Bottom 0.254: v11.43,111.47 v36.83,111.47 72.39,111.47 v73.66,110.2
CANL  (via drill 0.3)
  Top 0.254: CAN1.1 6.97,43.53 6.35,44.16 6.35,59.4 | 6.35,59.4 6.35,74.64 | 6.35,74.64 6.35,89.88 | 6.35,89.88 6.35,105.12 | 6.35,105.12 6.35,107.66 v11.43,112.74 | 77.47,46.05 CAN9.1 | 77.47,105.12 77.47,89.88 | 77.47,89.88 77.47,74.64 | 77.47,74.64 77.47,58.13 | 77.47,58.13 77.47,46.05 | CAN2.1 6.97,58.77 6.35,59.4 | CAN3.1 6.97,74.02 6.35,74.64 | CAN4.1 6.97,89.25 6.35,89.88 | CAN5.1 6.97,104.5 6.35,105.12 | v39.37,112.74 39.37,105.63 OLD.1 | CAN6.1 76.84,105.75 77.47,105.12 | CAN_STM32.1 76.84,90.5 77.47,89.88 | CAN7.1 76.84,75.27 77.47,74.64 | CAN8.1 76.84,58.75 77.47,58.13 | 77.47,46.05 77.47,39.08 74.93,36.54 68.46,36.54 63.38,41.62 CAN10.1 | v74.93,111.47 77.47,108.93 77.47,105.12
  Bottom 0.254: v11.43,112.74 v39.37,112.74 73.66,112.74 v74.93,111.47
CAP_24V  (1 unrouted)
  Top 1.778: U$3.P$1 38.42,39.4 38.42,39.3 38.1,38.98 38.1,37.81 | U$3.P$1 49.53,48.53 38,37 | U$3.P$1 51,49.04 51,48 45.17,42.17 45.03,42.17 38.86,36 37,36
  Bottom 1.778: 36,36.88 38.42,39.3 38.42,39.4 U$3.P$1 49.53,49.44 36,35.91 28.09,35.91 27,37 27,38 27.09,38.09 SUPER_CAP.1 | 36,36.88 35.03,35.91 30,35.91 27.09,38.81 SUPER_CAP.1 | SUPER_CAP.1 29,41.83 29,39 31.12,36.88 36,36.88 | SUPER_CAP.1 26,42.65 26,36.91 27,35.91 25.09,35.91 25,36 25,42 26.74,43.74 SUPER_CAP.1
  pour Top: 10.43,111.47 19.05,111.47 19.05,53.05 38.1,53.05 38.1,34 10.43,34
CAP_ANALOG_OUT  (4 unrouted)
GND  (2 unrouted)
MCU_VCC  (via drill 0.3)  (8 unrouted)
  Top 0.254: U$4.8 41.95,95.63 43.78,95.63 | 43.78,95.63 45.72,93.69 C3.1 47.41,92.81 v47.94,92.28 | v41.91,100.04 41.91,97.5 43.78,95.63 | v50,87 50,86.85 R9.2 R10.2 58.15,85.85 59,85 59,83 57.98,81.97 U1.8
  Bottom 0.254: v41.91,102.58 v41.91,100.04 | v47.94,92.28 50,90.22 v50,87
N$1
  Top 0.254: U$3.P$3 57.19,58.51 R1.2
N$2
  Top 0.254: CAPACITOR_MODE.A 61.53,67.25 R1.1
N$3
  Top 0.254: CAPACITOR_MODE.C 52.3,60.67 46.99,60.67 44.93,58.61 U$3.P$6
N$4
  Top 0.254: JP1.2 44.04,99.23 R5.1
N$5
  Top 0.254: BAT_STATUS.A 48.83,67.25 R2.1
N$6  (2 unrouted)
N$7  (1 unrouted)
N$8
  Top 0.254: VR1.2 54.19,98.77 R3.2 C1.1
N$13
  Top 0.254: U1.7 55.16,81.28 54.32,81.28 54.09,81.06 54.09,80.94 R8.2
N$14
  Top 0.254: U1.6 55.24,80.63 56.08,80.63 56.31,80.41 56.31,79.64 56,79.34 R7.2
N$15
  Top 0.254: U1.5 53,77.83 R6.2
SCL  (via drill 0.3)  (3 unrouted)
  Top 0.254: U1.2 52.17,81.33 54.92,84.08 | 54.92,84.08 R10.1 | v59,96 53.76,101.24 53.69,101.24 52.58,102.35 | v57,85 56.08,84.08 54.92,84.08
  Bottom 0.254: v59,96 59,87 v57,85
SDA  (via drill 0.3)  (3 unrouted)
  Top 0.254: U1.1 51,82.17 R9.1 48.21,86.94 v48.21,89 | v54,102 54.58,102.58
  Bottom 0.254: v48.21,89 47,90.21 47,100 49,102 v54,102
VIOUT  (via drill 0.3)  (1 unrouted)
  Top 0.254: U$4.7 44.23,94.33 C4.1 47.92,90.63 47.92,90.39 48.43,89.88 v50.8,89.88
  Bottom 0.254: v50.8,89.88 58.42,97.5

### Text on the board
tNames: ©CHENGMING ZHANG 2019 | ROBOMASTER POWER DIS V2.1